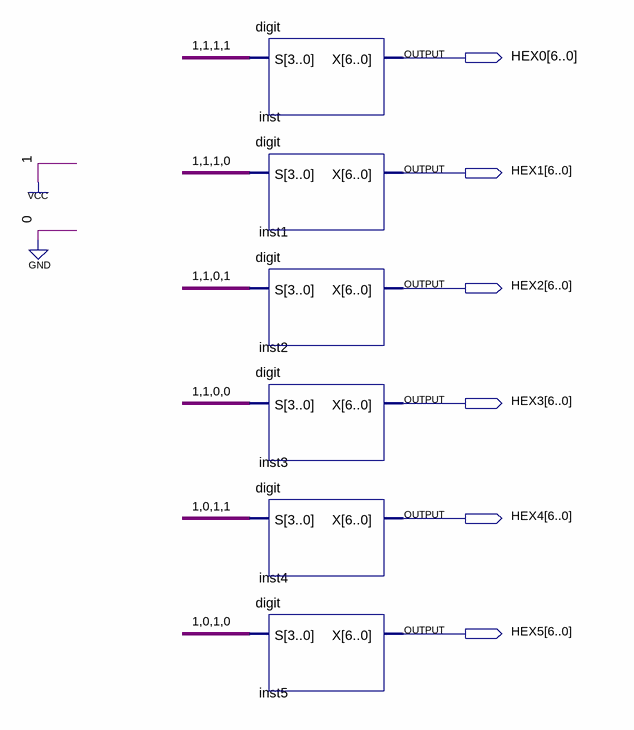
[diagram p0: schematic sheet]
// Quartus schematic hex_demo.bdf as structural Verilog: 6 symbols, 6 pins
module hex_demo (
  output [6:0] HEX0,
  output [6:0] HEX1,
  output [6:0] HEX2,
  output [6:0] HEX3,
  output [6:0] HEX4,
  output [6:0] HEX5
);

  digit inst (.S(4'b1111), .X(HEX0));
  digit inst1 (.S(4'b1110), .X(HEX1));
  digit inst2 (.S(4'b1101), .X(HEX2));
  digit inst3 (.S(4'b1100), .X(HEX3));
  digit inst4 (.S(4'b1011), .X(HEX4));
  digit inst5 (.S(4'b1010), .X(HEX5));
endmodule
